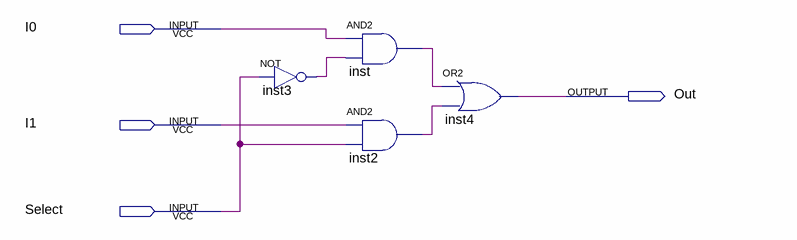
[diagram p0: schematic sheet]
// Quartus schematic MUX.bdf as structural Verilog: 4 symbols, 4 pins
module MUX (
  input  I0,
  input  I1,
  input  Select,
  output Out
);

  wire inst2_out, inst3_out, inst_out;

  not inst3 (inst3_out, Select);
  and inst (inst_out, I0, inst3_out);
  and inst2 (inst2_out, I1, Select);
  or inst4 (Out, inst_out, inst2_out);
endmodule
